# Altium schematic sheet 4) LPC1850_ Others.SchDoc
size 420 x 297 mm
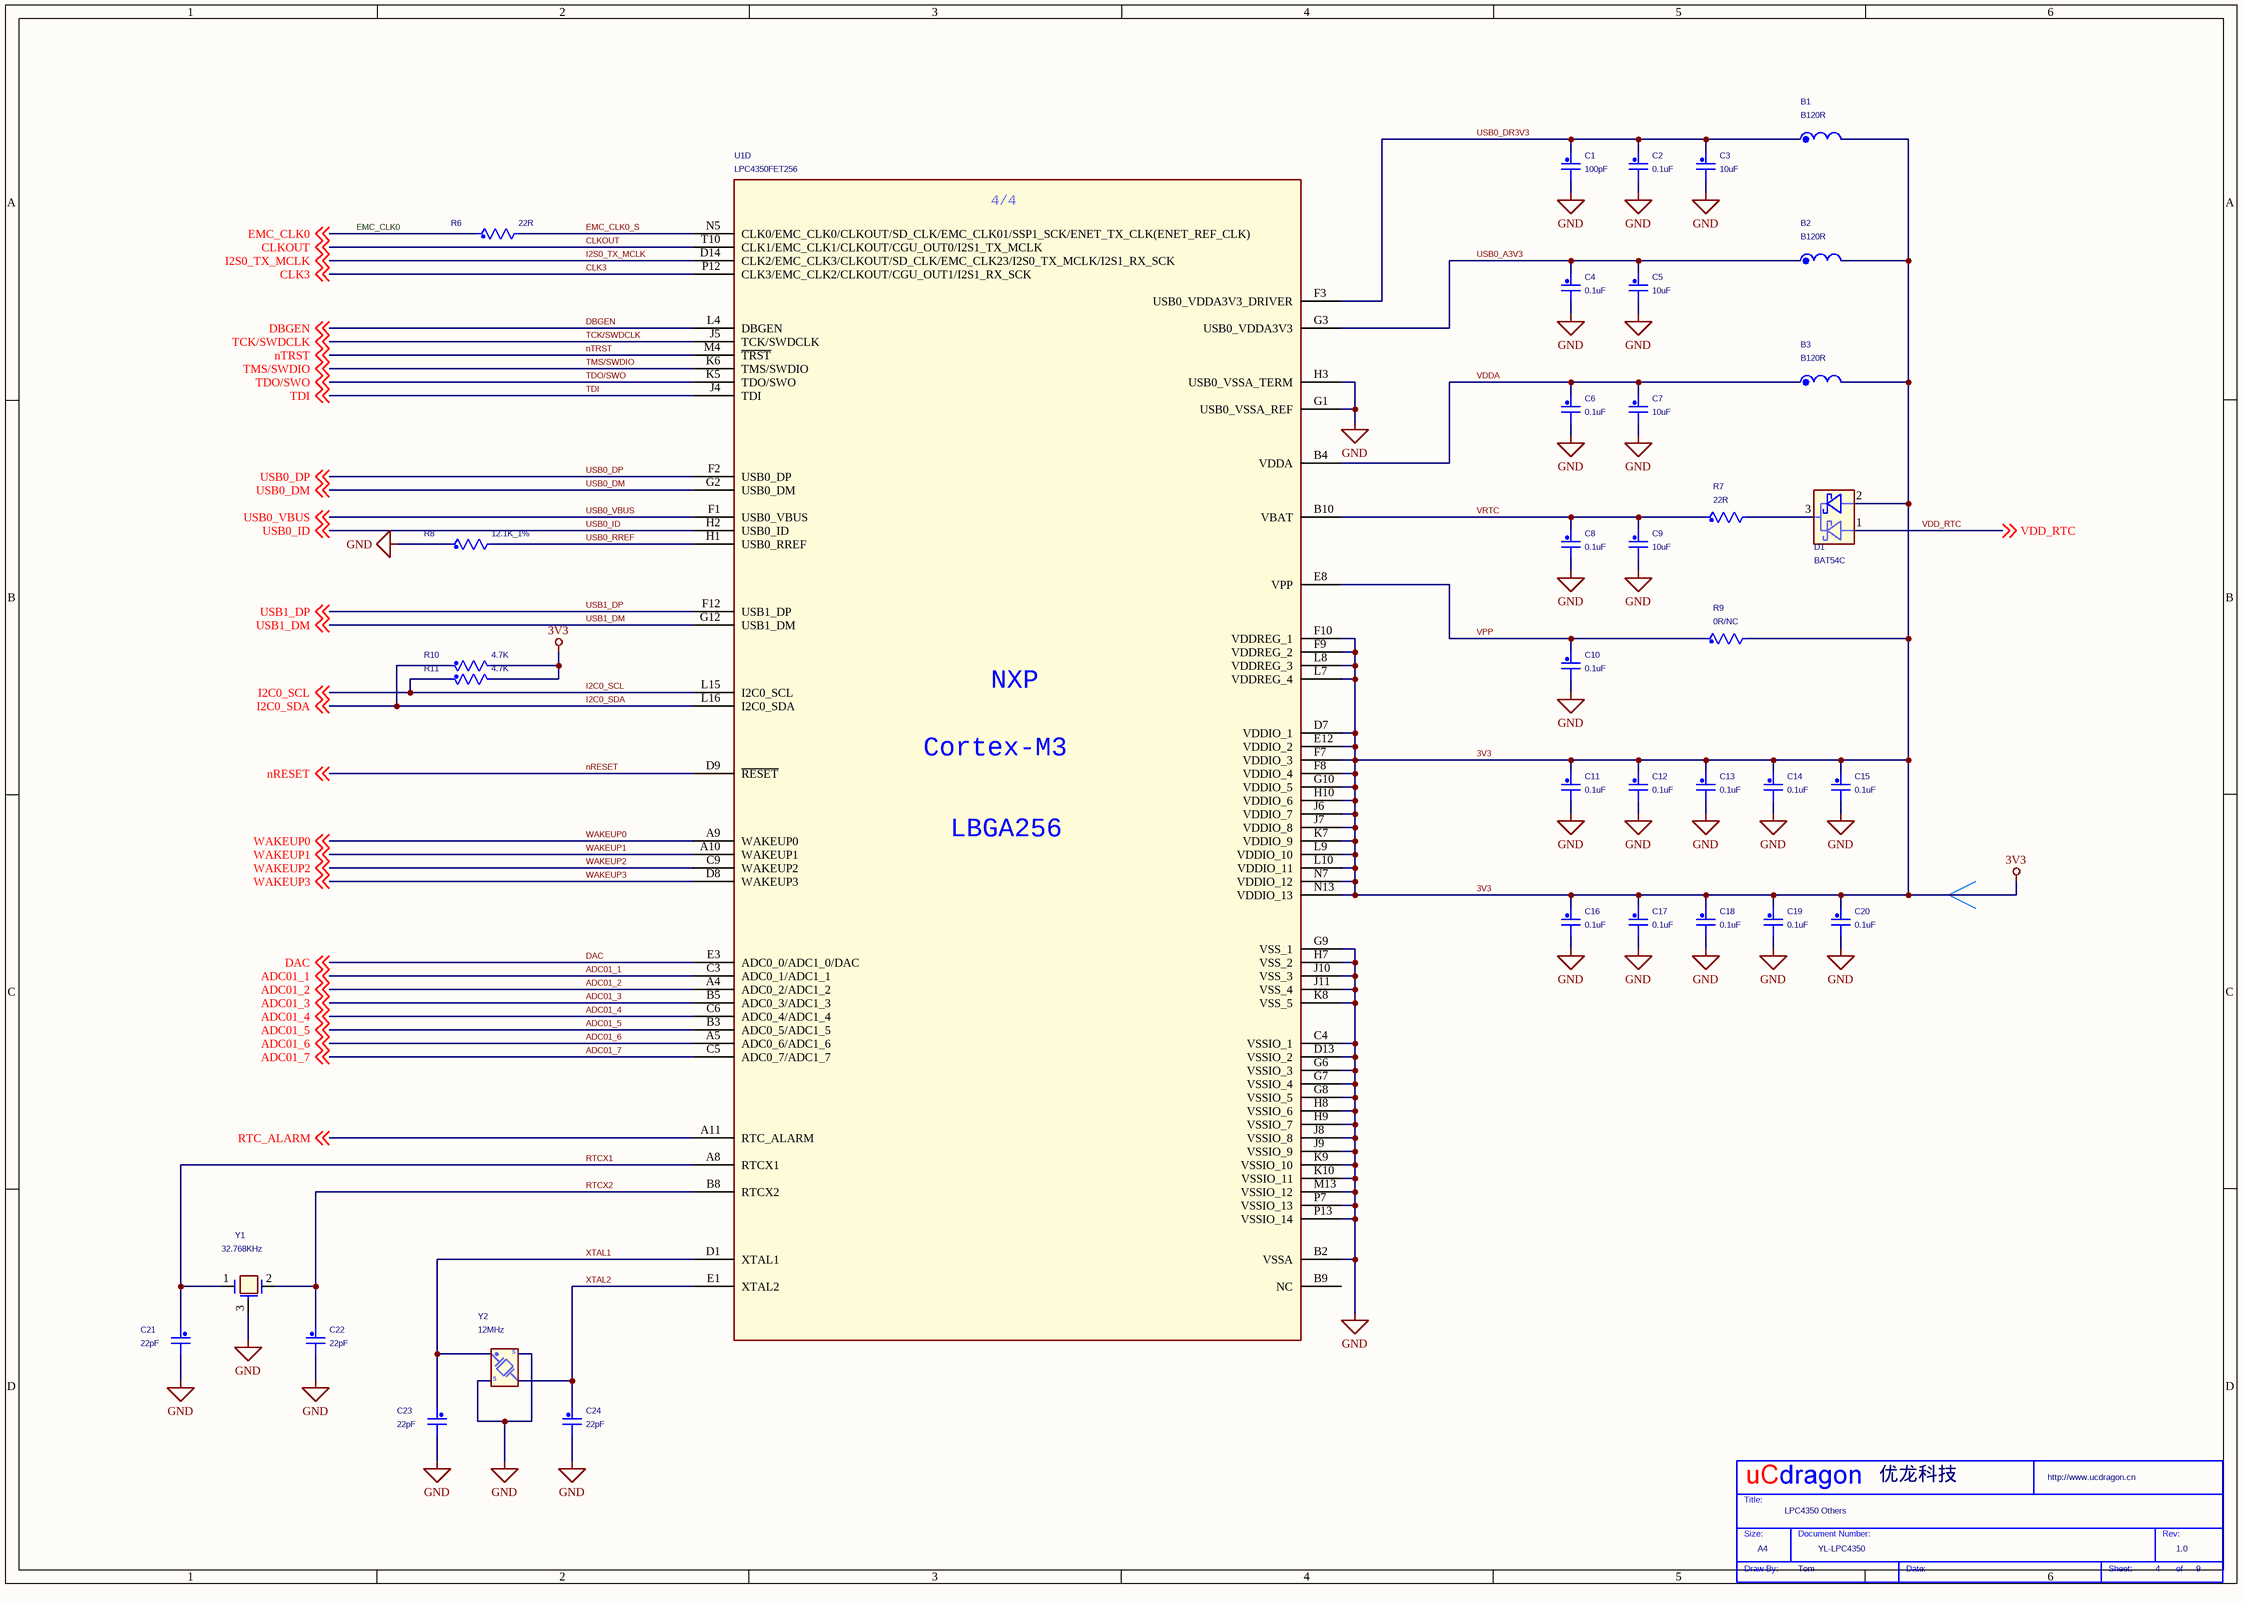
[diagram p0: 4) LPC1850_ Others.SchDoc]

## Parts
*  Company: 优龙科技  Drawing: Tom  Doc: YL-LPC4350  RevCode: 1.0  Title: LPC4350 Others  Page Size: A4  Page Number: 4  Page Count: 9  (hidden comment: My Title 0)  (graphical)
B1  B120R  [R0603]
B2  B120R  [R0603]
B3  B120R  [R0603]
C1  100pF  [CAP0805]
C2  0.1uF  [CAP0805]
C3  10uF  [CAP0805]
C4  0.1uF  [CAP0805]
C5  10uF  [CAP0805]
C6  0.1uF  [CAP0805]
C7  10uF  [CAP0805]
C8  0.1uF  [CAP0805]
C9  10uF  [CAP0805]
C10  0.1uF  [CAP0805]
C11  0.1uF  [CAP0805]
C12  0.1uF  [CAP0805]
C13  0.1uF  [CAP0805]
C14  0.1uF  [CAP0805]
C15  0.1uF  [CAP0805]
C16  0.1uF  [CAP0805]
C17  0.1uF  [CAP0805]
C18  0.1uF  [CAP0805]
C19  0.1uF  [CAP0805]
C20  0.1uF  [CAP0805]
C21  22pF  [CAP0805]
C22  22pF  [CAP0805]
C23  22pF  [CAP0805]
C24  22pF  [CAP0805]
D1  BAT54C  [SOT23]
R6  22R  [R0603]
R7  22R  [R0603]
R8  12.1K_1%  [R0603]
R9  0R/NC  [R0603]
R10  4.7K  [R0603]
R11  4.7K  [R0603]
U1  LPC4350FET256  [LBGA256]  (part D of 4)
Y1  32.768KHz  [XTAL5-SMT]
Y2  12MHz  [Y3225]

## Nets
3V3: B1.2 B2.2 B3.2 C11.1 C12.1 C13.1 C14.1 C15.1 C16.1 C17.1 C18.1 C19.1 C20.1 D1.2(K) R9.2 R10.2 R11.2 U1.D7(VDDIO_1) U1.E12(VDDIO_2) U1.F7(VDDIO_3) U1.F8(VDDIO_4) U1.F9(VDDREG_2) U1.F10(VDDREG_1) U1.G10(VDDIO_5) U1.H10(VDDIO_6) U1.J6(VDDIO_7) U1.J7(VDDIO_8) U1.K7(VDDIO_9) U1.L7(VDDREG_4) U1.L8(VDDREG_3) U1.L9(VDDIO_10) U1.L10(VDDIO_11) U1.N7(VDDIO_12) U1.N13(VDDIO_13)
GND: C1.2 C2.2 C3.2 C4.2 C5.2 C6.2 C7.2 C8.2 C9.2 C10.2 C11.2 C12.2 C13.2 C14.2 C15.2 C16.2 C17.2 C18.2 C19.2 C20.2 C21.2 C22.2 C23.2 C24.2 R8.1 U1.B2(VSSA) U1.C4(VSSIO_1) U1.D13(VSSIO_2) U1.G1(USB0_VSSA_REF) U1.G6(VSSIO_3) U1.G7(VSSIO_4) U1.G8(VSSIO_5) U1.G9(VSS_1) U1.H3(USB0_VSSA_TERM) U1.H7(VSS_2) U1.H8(VSSIO_6) U1.H9(VSSIO_7) U1.J8(VSSIO_8) U1.J9(VSSIO_9) U1.J10(VSS_3) U1.J11(VSS_4) U1.K8(VSS_5) U1.K9(VSSIO_10) U1.K10(VSSIO_11) U1.M13(VSSIO_12) U1.P7(VSSIO_13) U1.P13(VSSIO_14) Y1.3(GND) Y2.2 Y2.4
ADC01_1: U1.C3(ADC0_1/ADC1_1) ; off-sheet ADC01_1
ADC01_2: U1.A4(ADC0_2/ADC1_2) ; off-sheet ADC01_2
ADC01_3: U1.B5(ADC0_3/ADC1_3) ; off-sheet ADC01_3
ADC01_4: U1.C6(ADC0_4/ADC1_4) ; off-sheet ADC01_4
ADC01_5: U1.B3(ADC0_5/ADC1_5) ; off-sheet ADC01_5
ADC01_6: U1.A5(ADC0_6/ADC1_6) ; off-sheet ADC01_6
ADC01_7: U1.C5(ADC0_7/ADC1_7) ; off-sheet ADC01_7
CLK3: U1.P12(CLK3/EMC_CLK2/CLKOUT/CGU_OUT1/I2S1_RX_SCK) ; off-sheet CLK3
CLKOUT: U1.T10(CLK1/EMC_CLK1/CLKOUT/CGU_OUT0/I2S1_TX_MCLK) ; off-sheet CLKOUT
DAC: U1.E3(ADC0_0/ADC1_0/DAC) ; off-sheet DAC
DBGEN: U1.L4(DBGEN) ; off-sheet DBGEN
EMC_CLK0: R6.1 ; off-sheet EMC_CLK0
EMC_CLK0_S: R6.2 U1.N5(CLK0/EMC_CLK0/CLKOUT/SD_CLK/EMC_CLK01/SSP1_SCK/ENET_TX_CLK(ENET_REF_CLK))
I2C0_SCL: R11.1 U1.L15(I2C0_SCL) ; off-sheet I2C0_SCL
I2C0_SDA: R10.1 U1.L16(I2C0_SDA) ; off-sheet I2C0_SDA
I2S0_TX_MCLK: U1.D14(CLK2/EMC_CLK3/CLKOUT/SD_CLK/EMC_CLK23/I2S0_TX_MCLK/I2S1_RX_SCK) ; off-sheet I2S0_TX_MCLK
nRESET: U1.D9(~{RESET}) ; off-sheet nRESET
nTRST: U1.M4(~{TRST}) ; off-sheet nTRST
RTC_ALARM: U1.A11(RTC_ALARM) ; off-sheet RTC_ALARM
RTCX1: C21.1 U1.A8(RTCX1) Y1.1
RTCX2: C22.1 U1.B8(RTCX2) Y1.2
TCK/SWDCLK: U1.J5(TCK/SWDCLK) ; off-sheet TCK/SWDCLK
TDI: U1.J4(TDI) ; off-sheet TDI
TDO/SWO: U1.K5(TDO/SWO) ; off-sheet TDO/SWO
TMS/SWDIO: U1.K6(TMS/SWDIO) ; off-sheet TMS/SWDIO
USB0_A3V3: B2.1 C4.1 C5.1 U1.G3(USB0_VDDA3V3)
USB0_DM: U1.G2(USB0_DM) ; off-sheet USB0_DM
USB0_DP: U1.F2(USB0_DP) ; off-sheet USB0_DP
USB0_DR3V3: B1.1 C1.1 C2.1 C3.1 U1.F3(USB0_VDDA3V3_DRIVER)
USB0_ID: U1.H2(USB0_ID) ; off-sheet USB0_ID
USB0_RREF: R8.2 U1.H1(USB0_RREF)
USB0_VBUS: U1.F1(USB0_VBUS) ; off-sheet USB0_VBUS
USB1_DM: U1.G12(USB1_DM) ; off-sheet USB1_DM
USB1_DP: U1.F12(USB1_DP) ; off-sheet USB1_DP
VDD_RTC: D1.1(A) ; off-sheet VDD_RTC
VDDA: B3.1 C6.1 C7.1 U1.B4(VDDA)
VPP: C10.1 R9.1 U1.E8(VPP)
VRTC: C8.1 C9.1 R7.1 U1.B10(VBAT)
WAKEUP0: U1.A9(WAKEUP0) ; off-sheet WAKEUP0
WAKEUP1: U1.A10(WAKEUP1) ; off-sheet WAKEUP1
WAKEUP2: U1.C9(WAKEUP2) ; off-sheet WAKEUP2
WAKEUP3: U1.D8(WAKEUP3) ; off-sheet WAKEUP3
XTAL1: C23.1 U1.D1(XTAL1) Y2.1
XTAL2: C24.1 U1.E1(XTAL2) Y2.3
NetD1_3: D1.3(COM) R7.2

Not connected (* = marked no-connect by the designer): U1 B9(NC)

## Notes on the sheet
- (in symbol CRYSTAL 3225-2) S
- (in symbol LPC4350FET256, part D) 4/4; NXP; Cortex-M3; LBGA256
- (in symbol My Title 0) Title:; Size:; Document Number:; Rev:; Draw By:; Date:; Sheet:; of

## Library data of the parts
B1-B3 = Inductor PWR-SMD
C1-C24 = C_Generic: Toler.: 10%; P/N #1: C0603C104K4RAC; Voltage: 16V; Mfg #1: KEMET; Dielectric: X7R
R6-R9 = R_Generic_Dup2
R10 R11 = R_Generic_Dup1: Mfg #1: KOA SPEER; P/N #1: RK73H1JT1002F; Watts: 0.1W; Toler.: 1%; P/N #3: CR10-103J-T; Mfg #3: AVX
Y1 = XTAL1
Y2 = CRYSTAL 3225-2
* = My Title 0: WebSite: http://www.ucdragon.cn; Page Create Date: May 29, 2006